# Altium schematic sheet Display.SchDoc
size A; SheetNumber: 3; SheetTotal: 4
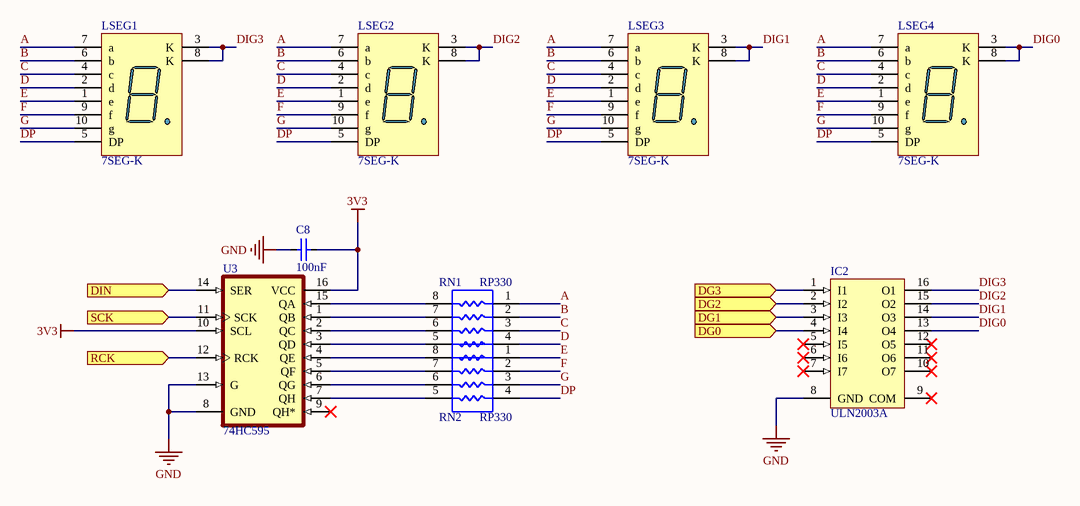
[diagram p0: Display.SchDoc]

## Parts
C8  100nF  [CAP_0805]
IC2  ULN2003A  [SOIC16]
LSEG1  7SEG-K  [LED7SEG]
LSEG2  7SEG-K  [LED7SEG]
LSEG3  7SEG-K  [LED7SEG]
LSEG4  7SEG-K  [LED7SEG]
RN1  RP330  [RN4-0805]
RN2  RP330  [RN4-0805]
U3  74HC595  [SOIC16]

## Ports
DG0 (in), DG1 (in), DG2 (in), DG3 (in), DIN (in), RCK (in), SCK (in)

## Nets
3V3: C8.1 U3.10(SCL) U3.16(VCC)
GND: C8.2 IC2.8(GND) U3.8(GND) U3.13(G)
A: LSEG1.7(a) LSEG2.7(a) LSEG3.7(a) LSEG4.7(a) RN1.1
B: LSEG1.6(b) LSEG2.6(b) LSEG3.6(b) LSEG4.6(b) RN1.2
C: LSEG1.4(c) LSEG2.4(c) LSEG3.4(c) LSEG4.4(c) RN1.3
D: LSEG1.2(d) LSEG2.2(d) LSEG3.2(d) LSEG4.2(d) RN1.4
DG0: IC2.4(I4) ; port DG0
DG1: IC2.3(I3) ; port DG1
DG2: IC2.2(I2) ; port DG2
DG3: IC2.1(I1) ; port DG3
DIG0: IC2.13(O4) LSEG4.3(K) LSEG4.8(K)
DIG1: IC2.14(O3) LSEG3.3(K) LSEG3.8(K)
DIG2: IC2.15(O2) LSEG2.3(K) LSEG2.8(K)
DIG3: IC2.16(O1) LSEG1.3(K) LSEG1.8(K)
DIN: U3.14(SER) ; port DIN
DP: LSEG1.5(DP) LSEG2.5(DP) LSEG3.5(DP) LSEG4.5(DP) RN2.4
E: LSEG1.1(e) LSEG2.1(e) LSEG3.1(e) LSEG4.1(e) RN2.1
F: LSEG1.9(f) LSEG2.9(f) LSEG3.9(f) LSEG4.9(f) RN2.2
G: LSEG1.10(g) LSEG2.10(g) LSEG3.10(g) LSEG4.10(g) RN2.3
RCK: U3.12(RCK) ; port RCK
SCK: U3.11(SCK) ; port SCK
NetRN1_5: RN1.5 U3.3(QD)
NetRN1_6: RN1.6 U3.2(QC)
NetRN1_7: RN1.7 U3.1(QB)
NetRN1_8: RN1.8 U3.15(QA)
NetRN2_5: RN2.5 U3.7(QH)
NetRN2_6: RN2.6 U3.6(QG)
NetRN2_7: RN2.7 U3.5(QF)
NetRN2_8: RN2.8 U3.4(QE)

Not connected (* = marked no-connect by the designer): IC2 5(I5)* 6(I6)* 7(I7)* 9(COM)* 10(O7)* 11(O6)* 12(O5)*; U3 9(QH*)*

## Library data of the parts
C8 = CapSMD: Capacitor; Value: 33p; Published: 8-Jun-2000; LatestRevisionDate: 17-Jul-2002; LatestRevisionNote: Re-released for DXP Platform.; PackageReference: RAD-0.3; Publisher: Altium Limited
IC2 = ULN2003A: High-Voltage, High-Current Darlington Array; LatestRevisionNote: Stylized 3D Model Added.; Publisher: Altium Limited; Value: ULN2003A
LSEG1-LSEG4 = LED7SEG-K: 14.2 mm General Purpose Blue 7-Segment Display: CC, RH DP, Gray Surface; MinimumIntensity: 2020 ucd; Note: IF = 10 mA; Published: 8-Jun-2000; LatestRevisionDate: 17-Dec-2003; LatestRevisionNote: Schematic revised, PCB Footprint replaced.; DatasheetDocument: 24-Sep-2002; PackageDocument: 24-Sep-2002; PackageReference: H; Publisher: Altium Limited; Colour: Blue; ComponentLink1Description: Manufacturer Link; ComponentLink1URL: http://www.agilent.com/
RN1 RN2 = RN4-Dual
U3 = 74HC595: 8-bit Serial-Input/Serial or Parallel Output Shift Register with Latched 3-state Outputs